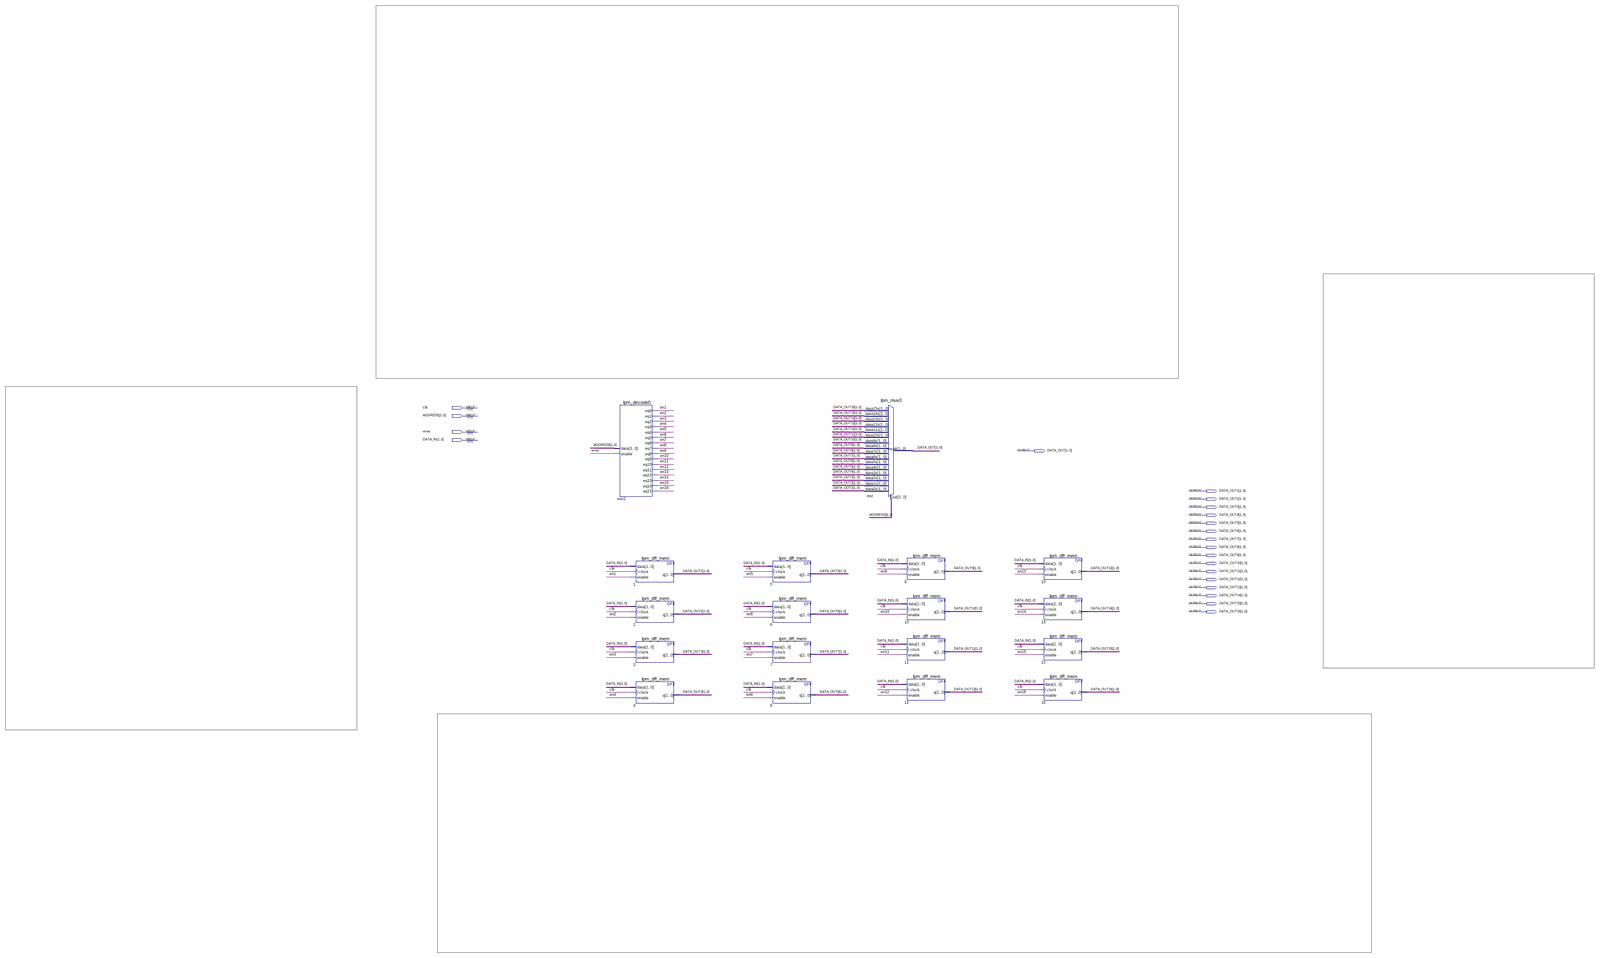
[diagram p0: schematic sheet, whole]
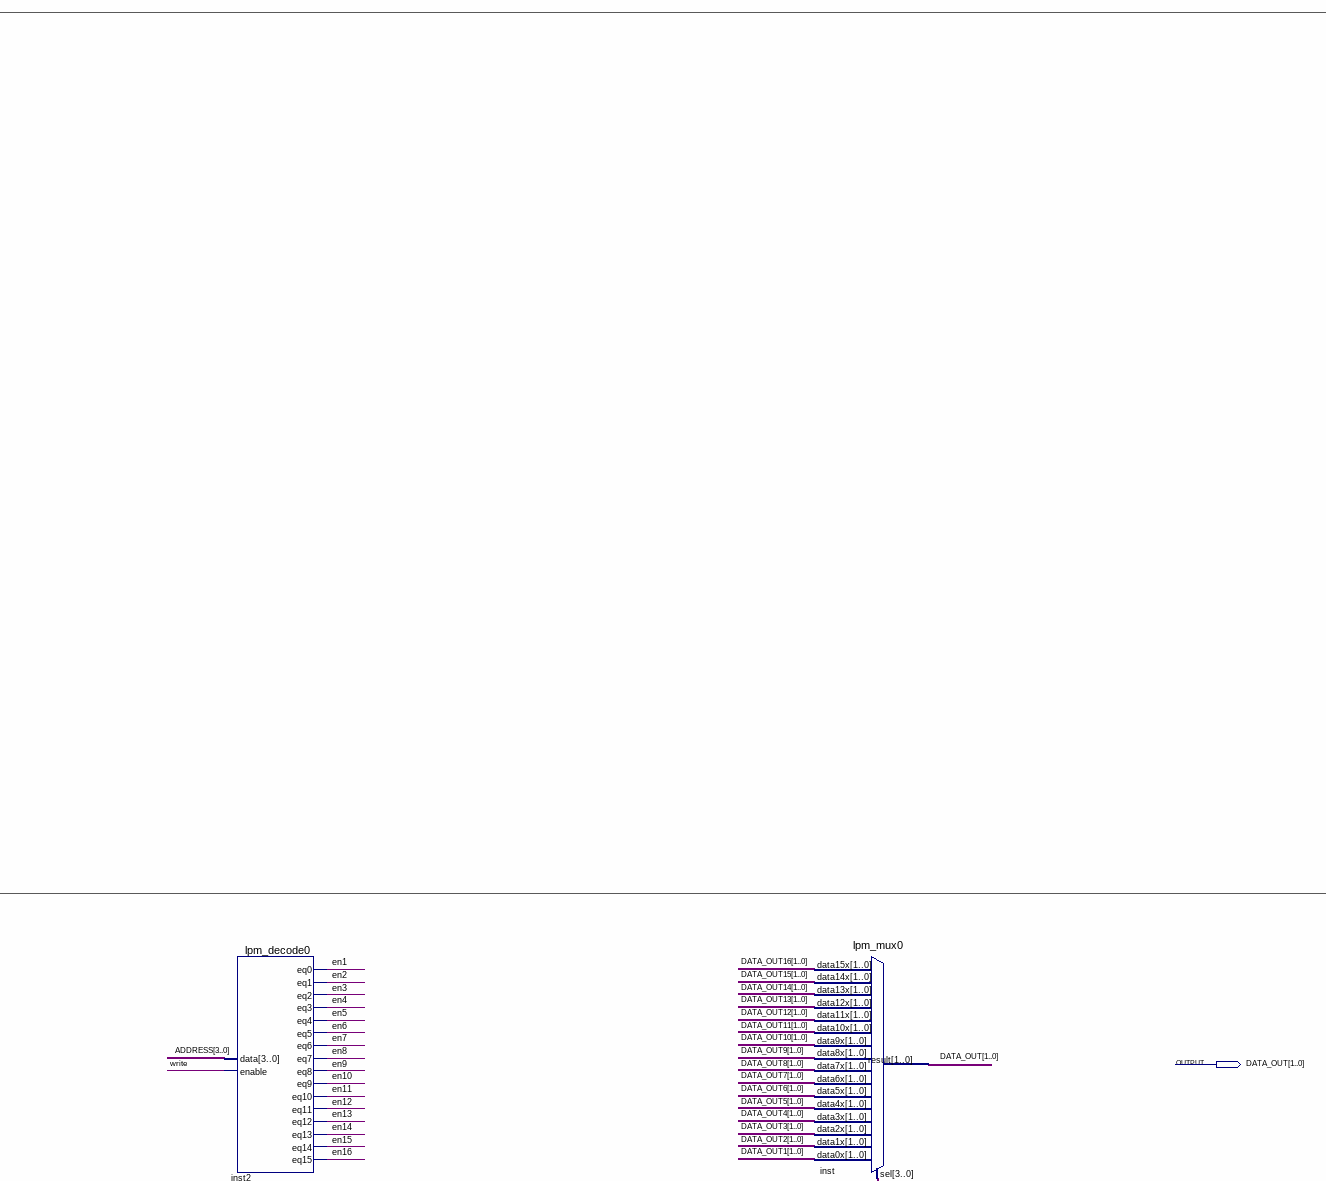
[diagram p1: schematic sheet, upper centre part]
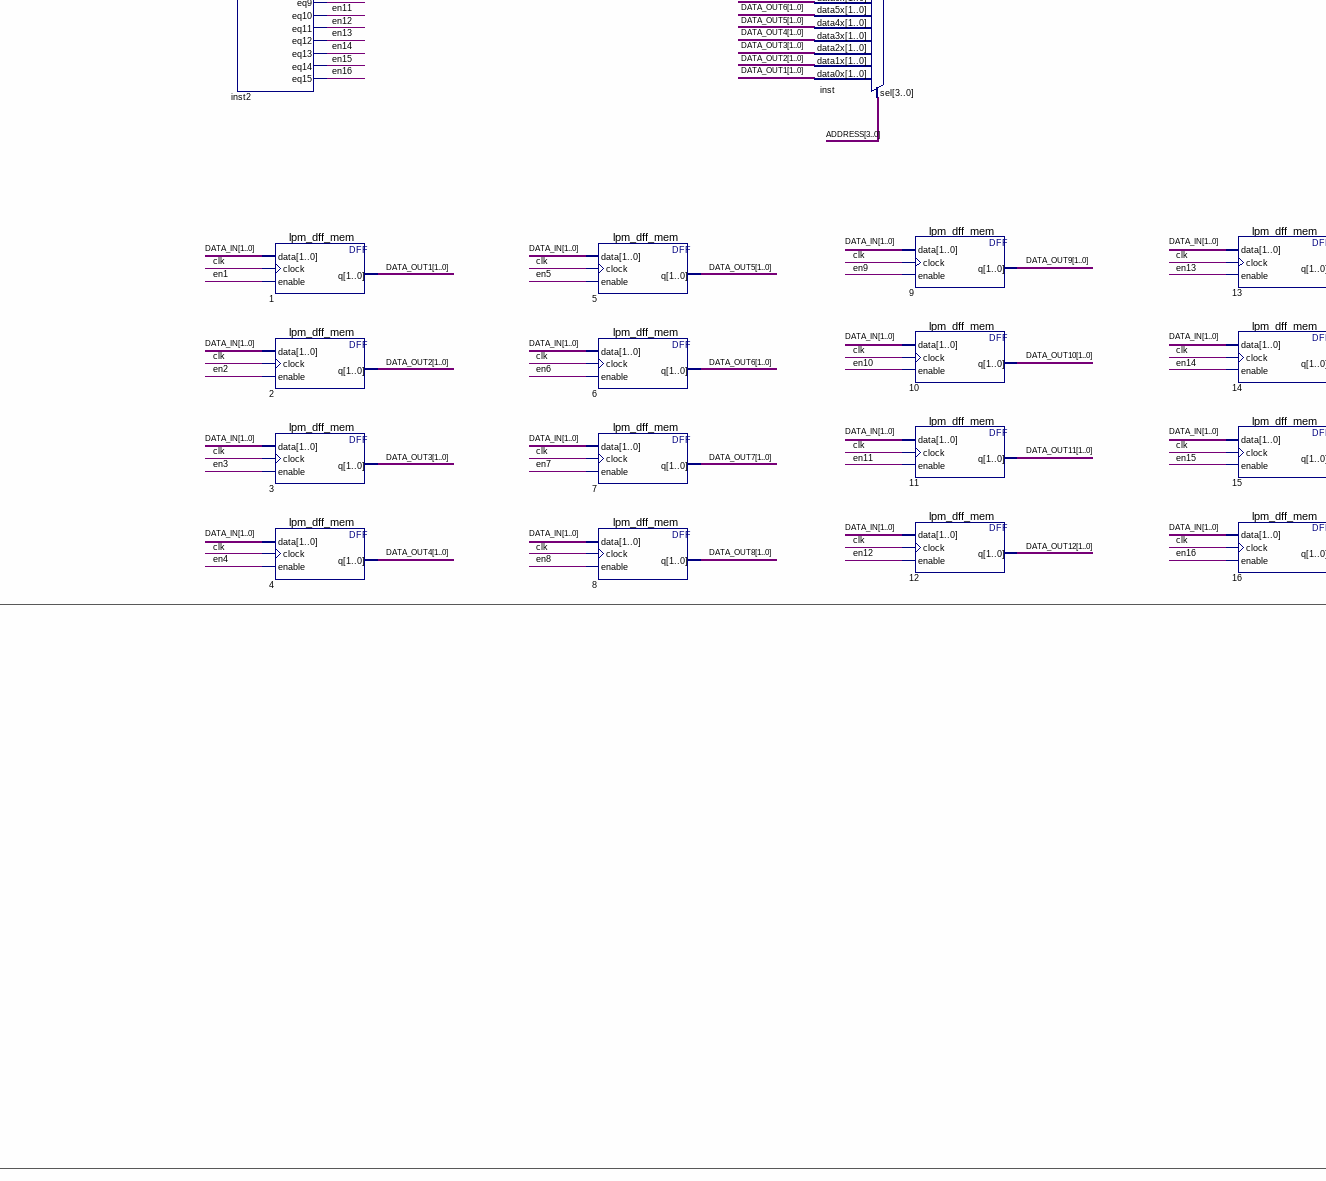
[diagram p2: schematic sheet, lower centre part]
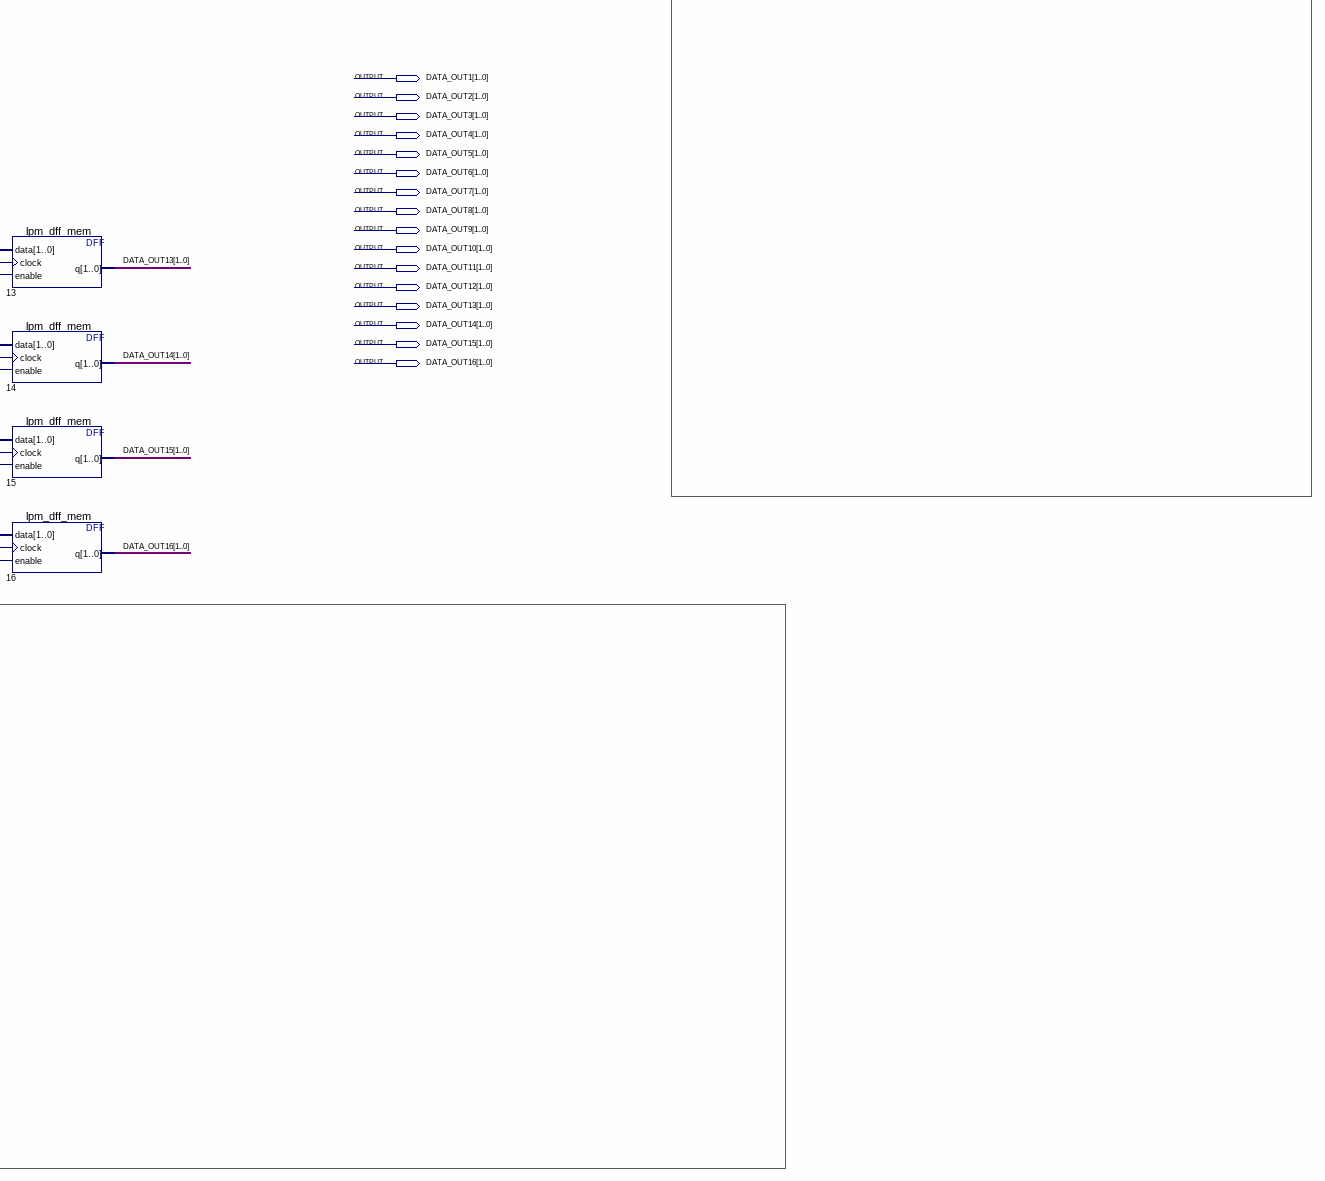
[diagram p3: schematic sheet, lower right part]
// Quartus schematic PHT.bdf as structural Verilog: 18 symbols, 21 pins
module PHT (
  input  clk,
  input  [3:0] ADDRESS,
  input  write,
  input  [1:0] DATA_IN,
  output [1:0] DATA_OUT,
  output [1:0] DATA_OUT1,
  output [1:0] DATA_OUT2,
  output [1:0] DATA_OUT3,
  output [1:0] DATA_OUT4,
  output [1:0] DATA_OUT5,
  output [1:0] DATA_OUT6,
  output [1:0] DATA_OUT7,
  output [1:0] DATA_OUT8,
  output [1:0] DATA_OUT9,
  output [1:0] DATA_OUT10,
  output [1:0] DATA_OUT11,
  output [1:0] DATA_OUT12,
  output [1:0] DATA_OUT13,
  output [1:0] DATA_OUT14,
  output [1:0] DATA_OUT15,
  output [1:0] DATA_OUT16
);

  wire en1, en2, en3, en4, en5, en6, en7, en8, en9, en10, en11, en12, en13, en14, en15, en16;

  lpm_decode0 inst2 (
    .data(ADDRESS), .enable(write), .eq0(en1), .eq1(en2), .eq2(en3), .eq3(en4), .eq4(en5), .eq5(en6),
    .eq6(en7), .eq7(en8), .eq8(en9), .eq9(en10), .eq10(en11), .eq11(en12), .eq12(en13), .eq13(en14),
    .eq14(en15), .eq15(en16));
  lpm_dff_mem u_1 (.data(DATA_IN), .clock(clk), .enable(en1), .q(DATA_OUT1));
  lpm_dff_mem u_2 (.data(DATA_IN), .clock(clk), .enable(en2), .q(DATA_OUT2));
  lpm_dff_mem u_3 (.data(DATA_IN), .clock(clk), .enable(en3), .q(DATA_OUT3));
  lpm_dff_mem u_4 (.data(DATA_IN), .clock(clk), .enable(en4), .q(DATA_OUT4));
  lpm_dff_mem u_5 (.data(DATA_IN), .clock(clk), .enable(en5), .q(DATA_OUT5));
  lpm_dff_mem u_6 (.data(DATA_IN), .clock(clk), .enable(en6), .q(DATA_OUT6));
  lpm_dff_mem u_7 (.data(DATA_IN), .clock(clk), .enable(en7), .q(DATA_OUT7));
  lpm_dff_mem u_8 (.data(DATA_IN), .clock(clk), .enable(en8), .q(DATA_OUT8));
  lpm_mux0 inst (
    .data15x(DATA_OUT16), .data14x(DATA_OUT15), .data13x(DATA_OUT14), .data12x(DATA_OUT13),
    .data11x(DATA_OUT12), .data10x(DATA_OUT11), .data9x(DATA_OUT10), .data8x(DATA_OUT9), .data7x(DATA_OUT8),
    .data6x(DATA_OUT7), .data5x(DATA_OUT6), .data4x(DATA_OUT5), .data3x(DATA_OUT4), .data2x(DATA_OUT3),
    .data1x(DATA_OUT2), .data0x(DATA_OUT1), .sel(ADDRESS), .result(DATA_OUT));
  lpm_dff_mem u_9 (.data(DATA_IN), .clock(clk), .enable(en9), .q(DATA_OUT9));
  lpm_dff_mem u_10 (.data(DATA_IN), .clock(clk), .enable(en10), .q(DATA_OUT10));
  lpm_dff_mem u_11 (.data(DATA_IN), .clock(clk), .enable(en11), .q(DATA_OUT11));
  lpm_dff_mem u_12 (.data(DATA_IN), .clock(clk), .enable(en12), .q(DATA_OUT12));
  lpm_dff_mem u_13 (.data(DATA_IN), .clock(clk), .enable(en13), .q(DATA_OUT13));
  lpm_dff_mem u_14 (.data(DATA_IN), .clock(clk), .enable(en14), .q(DATA_OUT14));
  lpm_dff_mem u_15 (.data(DATA_IN), .clock(clk), .enable(en15), .q(DATA_OUT15));
  lpm_dff_mem u_16 (.data(DATA_IN), .clock(clk), .enable(en16), .q(DATA_OUT16));
endmodule
